# Altium schematic sheet resource.SchDoc
size A2
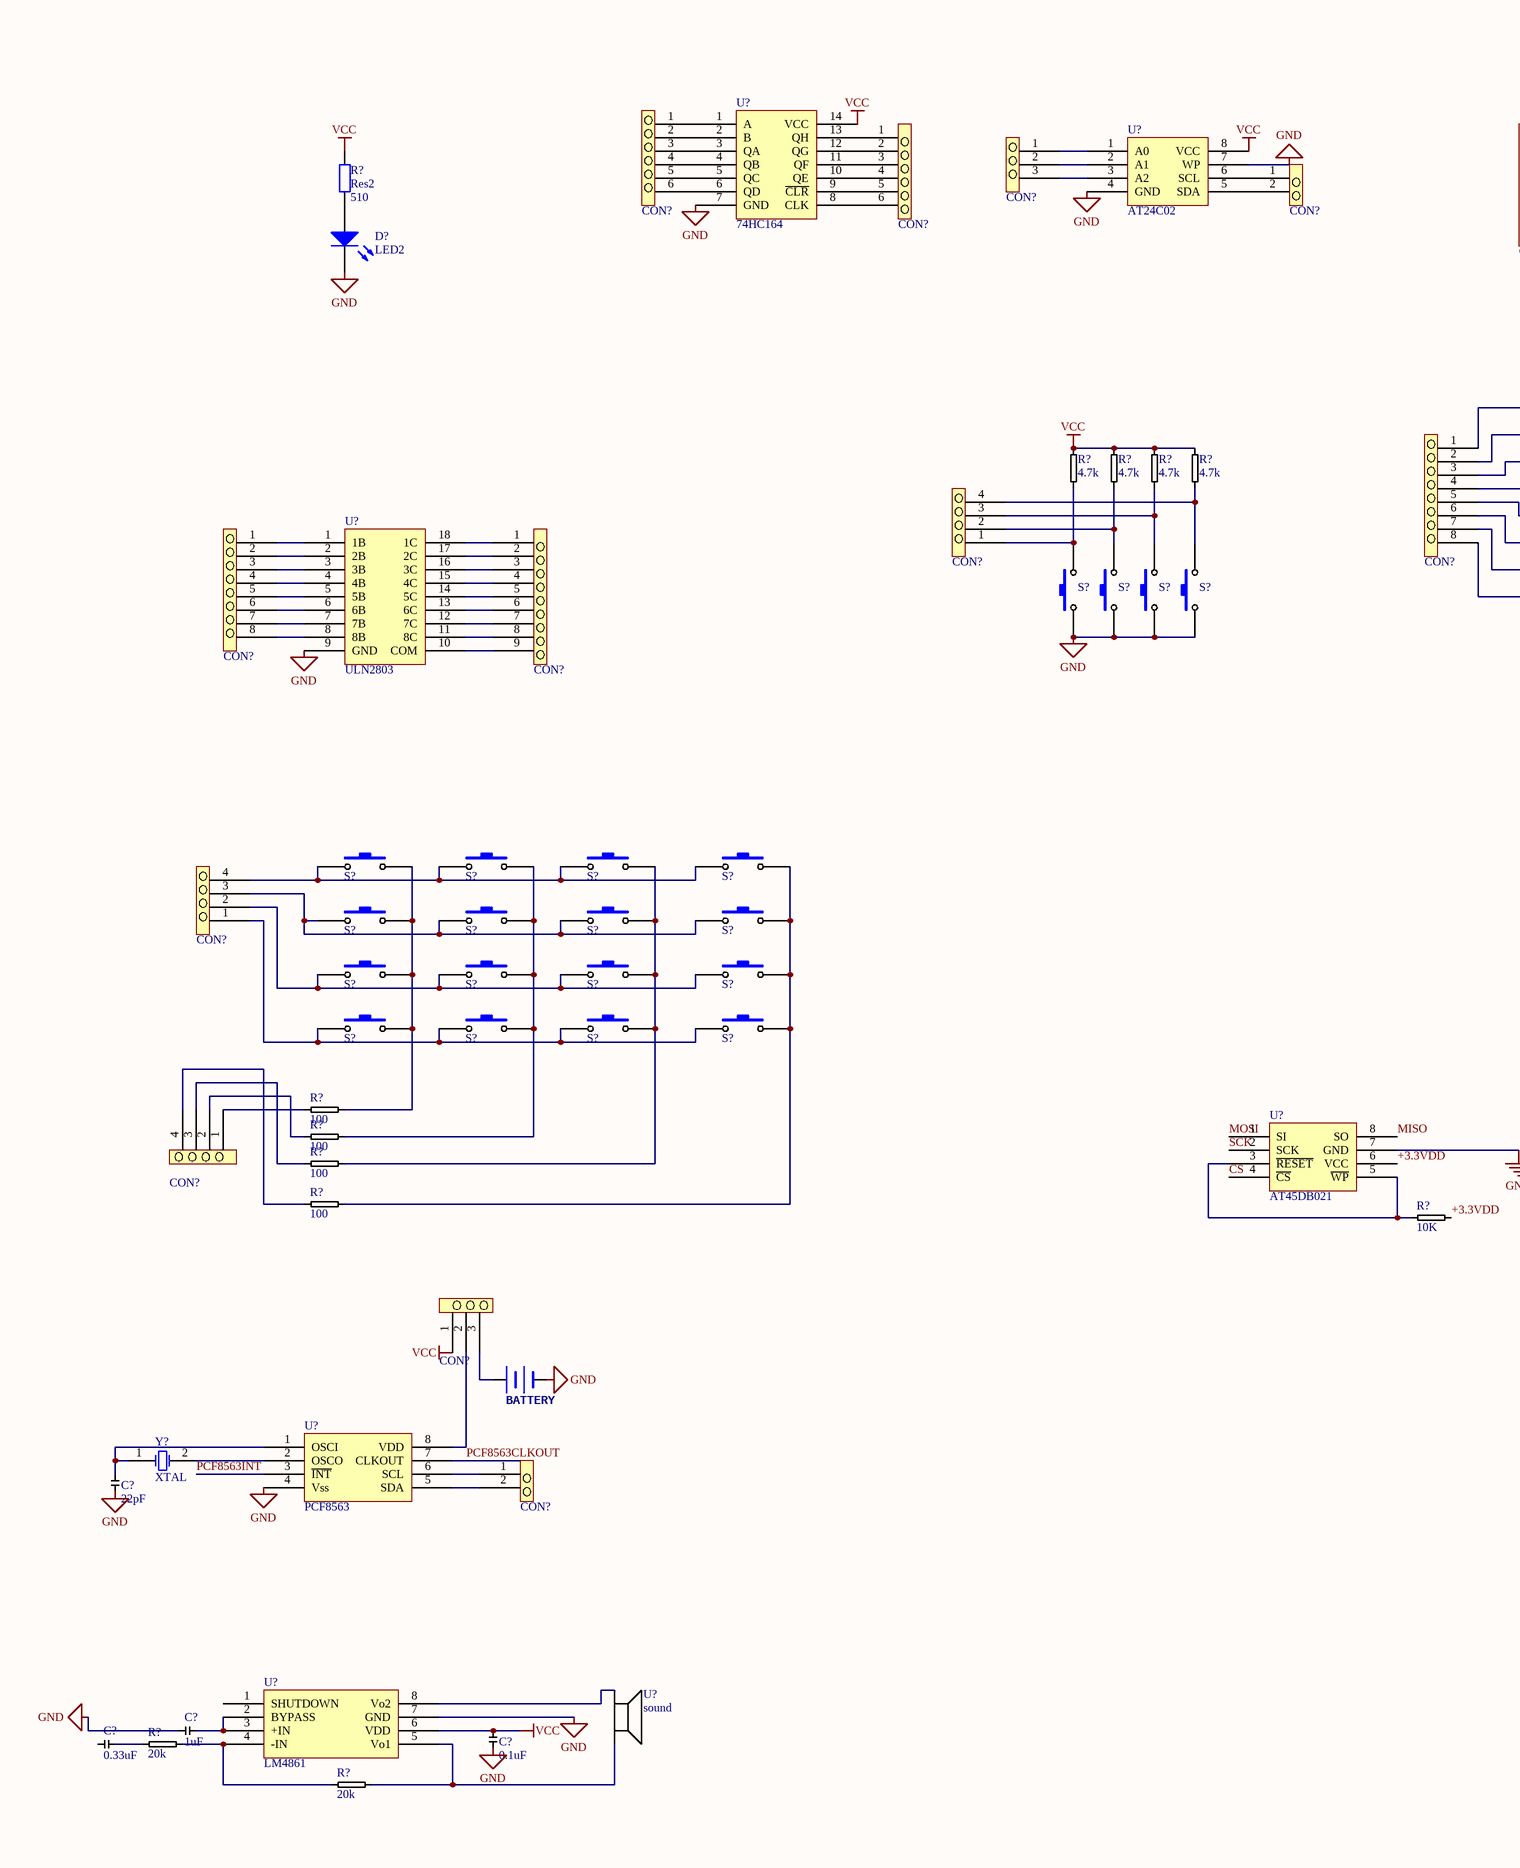
[diagram p0: resource.SchDoc, left]
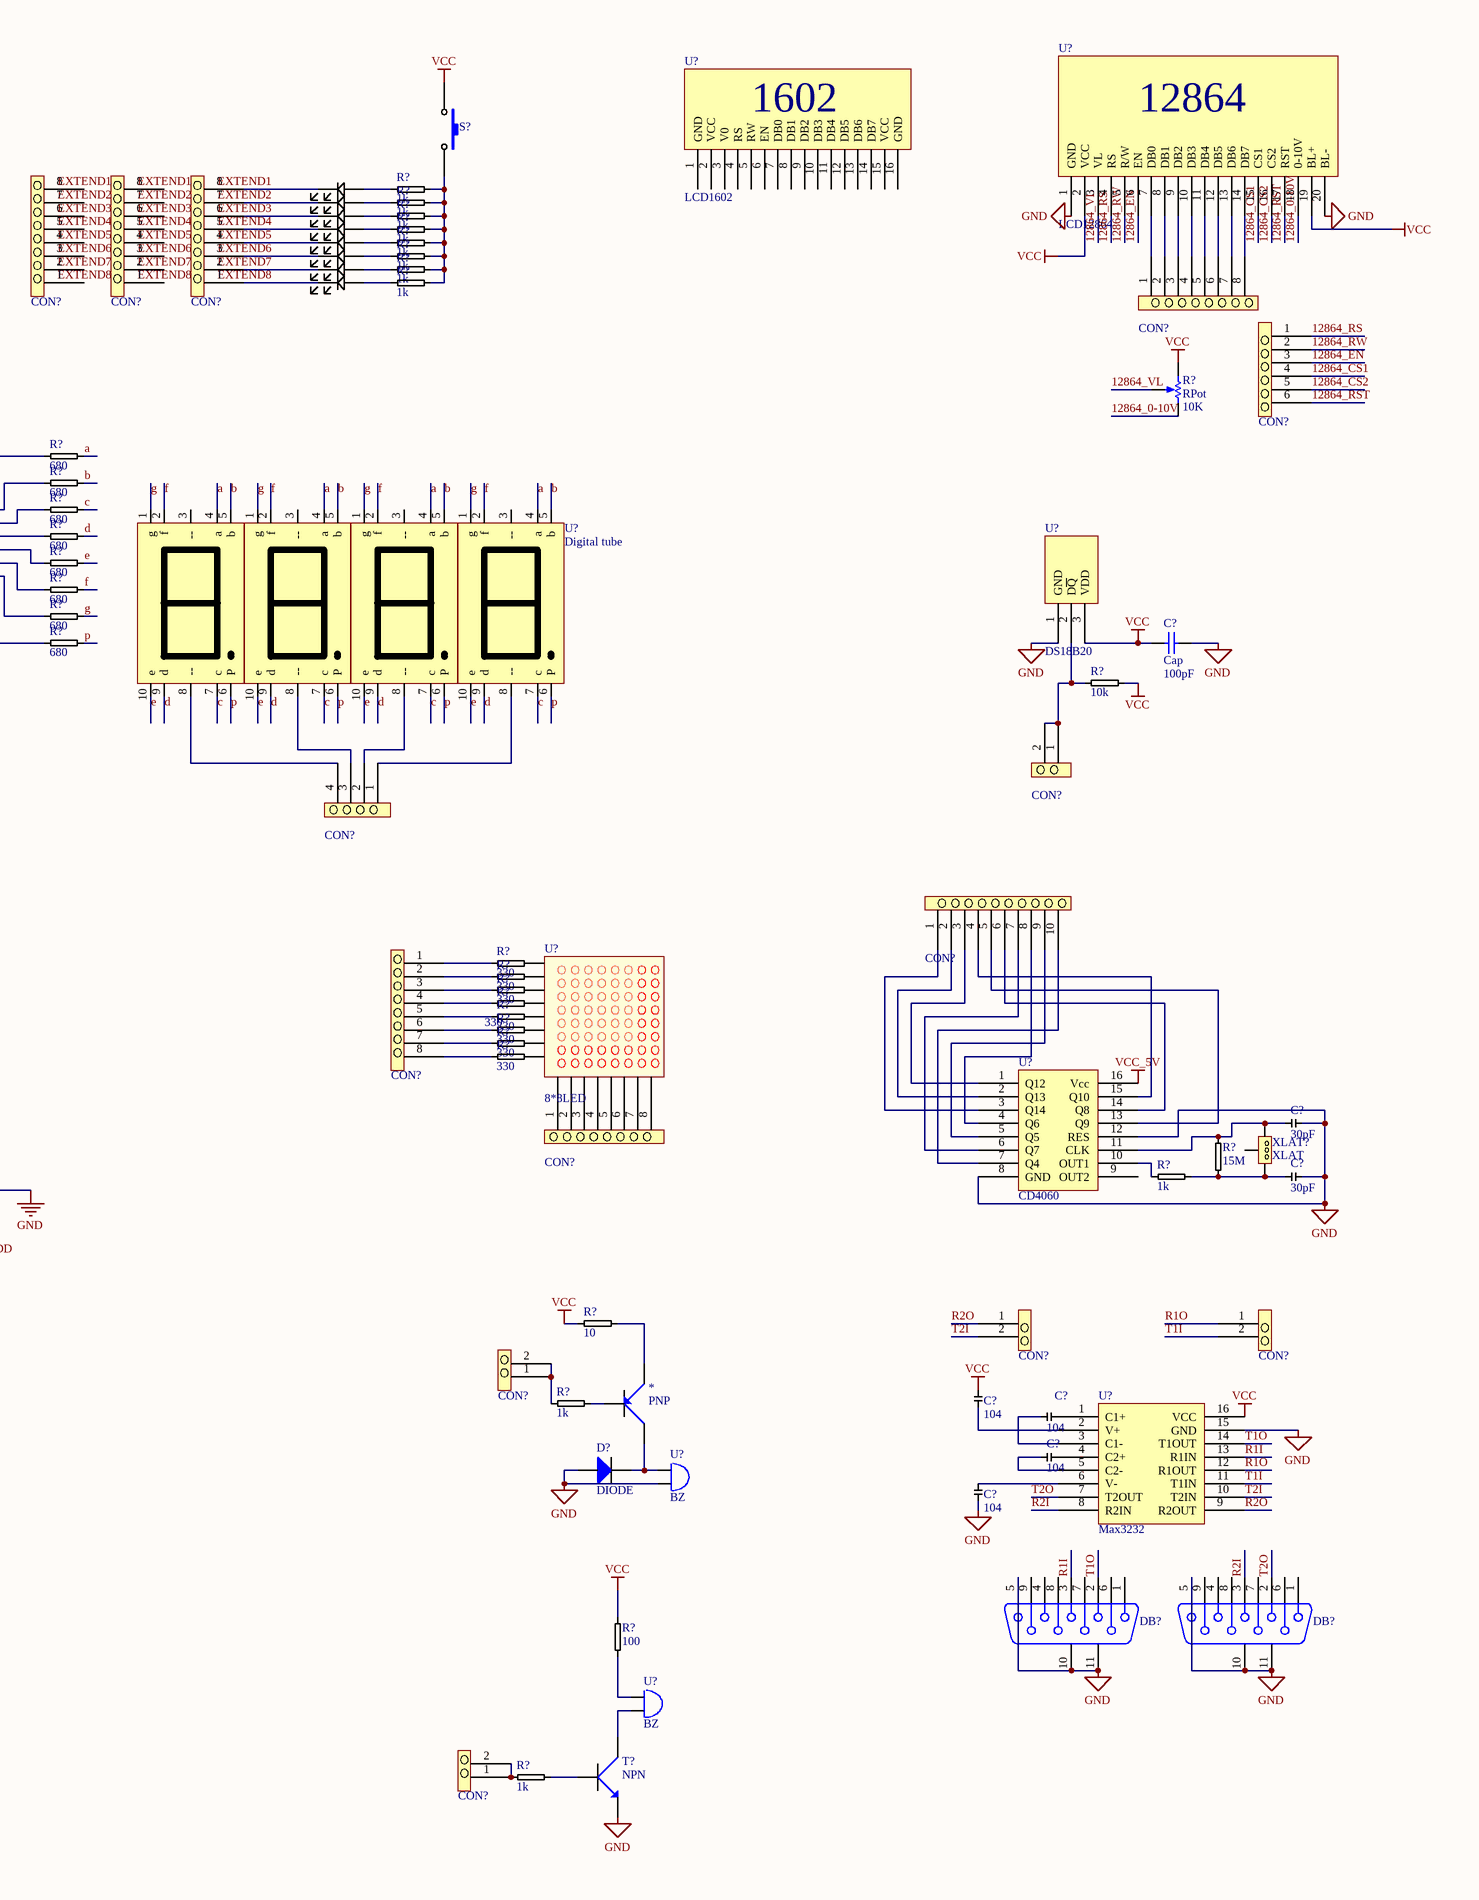
[diagram p1: resource.SchDoc, right]

## Parts
(Parts that share a designator on the sheet are numbered #1, #2 ... from top to bottom, then left to right.)
*  PNP
BT1  BATTERY  [BAT]
C?#1  Cap  value 100pF  [RAD-0.3]
C?#2  value 30pF  [0805]  (hidden comment: CAP)
C?#3  value 30pF  [0805]  (hidden comment: CAP)
C?#4  value 104  [0805]  (hidden comment: CAP)
C?#5  value 104  [0805]  (hidden comment: CAP)
C?#6  value 104  [0805]  (hidden comment: CAP)
C?#7  value 104  [0805]  (hidden comment: CAP)
C?#8  value 22pF  [0805]  (hidden comment: CAP)
C?#9  value 1uF  [0805]  (hidden comment: CAP)
C?#10  value 0.33uF  [0805]  (hidden comment: CAP)
C?#11  value 0.1uF  [0805]  (hidden comment: CAP)
CON?#1  Connector6  [SIP6]  (value not drawn)
CON?#2  Connector6  [SIP6]  (value not drawn)
CON?#3  Connector3  [SIP3]  (value not drawn)
CON?#4  Connector2  [SIP3]  (value not drawn)
CON?#5  Connector8  [SIP4]  (value not drawn)
CON?#6  Connector8  [SIP4]  (value not drawn)
CON?#7  Connector8  [SIP4]  (value not drawn)
CON?#8  Connector8  [SIP4]  (value not drawn)
CON?#9  Connector6  [SIP6]  (value not drawn)
CON?#10  Connector8  [SIP4]  (value not drawn)
CON?#11  Connector8  [SIP4]  (value not drawn)
CON?#12  Connector9  [SIP4]  (value not drawn)
CON?#13  Connector4  [SIP4]  (value not drawn)
CON?#14  Connector2  [SIP3]  (value not drawn)
CON?#15  Connector4  [SIP4]  (value not drawn)
CON?#16  Connector10  [SIP4]  (value not drawn)
CON?#17  Connector8  [SIP4]  (value not drawn)
CON?#18  Connector4  [SIP4]  (value not drawn)
CON?#19  Connector8  [SIP4]  (value not drawn)
CON?#20  Connector4  [SIP4]  (value not drawn)
CON?#21  Connector2  [SIP3]  (value not drawn)
CON?#22  Connector2  [SIP3]  (value not drawn)
CON?#23  Connector3  [SIP3]  (value not drawn)
CON?#24  Connector2  [SIP3]  (value not drawn)
CON?#25  Connector2  [SIP3]  (value not drawn)
CON?#26  Connector2  [SIP3]  (value not drawn)
D?#1  LED2  [LEDPOWER]
D?#2  DIODE
DB?#1  D Connector 9  [DB9_2]  (value not drawn)
DB?#2  D Connector 9  [DB9_2]  (value not drawn)
LED?#1  LED  [LEDpower]  (value not drawn)
LED?#2  LED  [LEDpower]  (value not drawn)
LED?#3  LED  [LEDpower]  (value not drawn)
LED?#4  LED  [LEDpower]  (value not drawn)
LED?#5  LED  [LEDpower]  (value not drawn)
LED?#6  LED  [LEDpower]  (value not drawn)
LED?#7  LED  [LEDpower]  (value not drawn)
LED?#8  LED  [LEDpower]  (value not drawn)
R?#1  value 1k  [0805]  (hidden comment: RESISTOR)
R?#2  value 1k  [0805]  (hidden comment: RESISTOR)
R?#3  value 1k  [0805]  (hidden comment: RESISTOR)
R?#4  value 1k  [0805]  (hidden comment: RESISTOR)
R?#5  Res2  value 510  [0805]
R?#6  value 1k  [0805]  (hidden comment: RESISTOR)
R?#7  value 1k  [0805]  (hidden comment: RESISTOR)
R?#8  value 1k  [0805]  (hidden comment: RESISTOR)
R?#9  value 1k  [0805]  (hidden comment: RESISTOR)
R?#10  RPot  value 10K  [VR5]
R?#11  value 680  [0805]  (hidden comment: RESISTOR)
R?#12  value 680  [0805]  (hidden comment: RESISTOR)
R?#13  value 680  [0805]  (hidden comment: RESISTOR)
R?#14  value 4.7k  [0805]  (hidden comment: RESISTOR)
R?#15  value 4.7k  [0805]  (hidden comment: RESISTOR)
R?#16  value 4.7k  [0805]  (hidden comment: RESISTOR)
R?#17  value 4.7k  [0805]  (hidden comment: RESISTOR)
R?#18  value 680  [0805]  (hidden comment: RESISTOR)
R?#19  value 680  [0805]  (hidden comment: RESISTOR)
R?#20  value 680  [0805]  (hidden comment: RESISTOR)
R?#21  value 680  [0805]  (hidden comment: RESISTOR)
R?#22  value 680  [0805]  (hidden comment: RESISTOR)
R?#23  value 10k  [0805]  (hidden comment: RESISTOR)
R?#24  value 330  [0805]  (hidden comment: RESISTOR)
R?#25  value 330  [0805]  (hidden comment: RESISTOR)
R?#26  value 330  [0805]  (hidden comment: RESISTOR)
R?#27  value 330  [0805]  (hidden comment: RESISTOR)
R?#28  value 330  [0805]  (hidden comment: RESISTOR)
R?#29  value 330  [0805]  (hidden comment: RESISTOR)
R?#30  value 330  [0805]  (hidden comment: RESISTOR)
R?#31  value 330  [0805]  (hidden comment: RESISTOR)
R?#32  value 100  [0805]  (hidden comment: RESISTOR)
R?#33  value 15M  [0805]  (hidden comment: RESISTOR)
R?#34  value 100  [0805]  (hidden comment: RESISTOR)
R?#35  value 1k  [0805]  (hidden comment: RESISTOR)
R?#36  value 100  [0805]  (hidden comment: RESISTOR)
R?#37  value 100  [0805]  (hidden comment: RESISTOR)
R?#38  value 10K  [0805]  (hidden comment: RESISTOR)
R?#39  value 10  [0805]  (hidden comment: RESISTOR)
R?#40  value 1k  [0805]  (hidden comment: RESISTOR)
R?#41  value 100  [0805]  (hidden comment: RESISTOR)
R?#42  value 20k  [0805]  (hidden comment: RESISTOR)
R?#43  value 1k  [0805]  (hidden comment: RESISTOR)
R?#44  value 20k  [0805]  (hidden comment: RESISTOR)
S?#1  SW-PB  [SW-PB]  (value not drawn)
S?#2  SW-PB  [SW-PB]  (value not drawn)
S?#3  SW-PB  [SW-PB]  (value not drawn)
S?#4  SW-PB  [SW-PB]  (value not drawn)
S?#5  SW-PB  [SW-PB]  (value not drawn)
S?#6  SW-PB  [SW-PB]  (value not drawn)
S?#7  SW-PB  [SW-PB]  (value not drawn)
S?#8  SW-PB  [SW-PB]  (value not drawn)
S?#9  SW-PB  [SW-PB]  (value not drawn)
S?#10  SW-PB  [SW-PB]  (value not drawn)
S?#11  SW-PB  [SW-PB]  (value not drawn)
S?#12  SW-PB  [SW-PB]  (value not drawn)
S?#13  SW-PB  [SW-PB]  (value not drawn)
S?#14  SW-PB  [SW-PB]  (value not drawn)
S?#15  SW-PB  [SW-PB]  (value not drawn)
S?#16  SW-PB  [SW-PB]  (value not drawn)
S?#17  SW-PB  [SW-PB]  (value not drawn)
S?#18  SW-PB  [SW-PB]  (value not drawn)
S?#19  SW-PB  [SW-PB]  (value not drawn)
S?#20  SW-PB  [SW-PB]  (value not drawn)
S?#21  SW-PB  [SW-PB]  (value not drawn)
T?  NPN
U?#1  LCD12864
U?#2  LCD1602
U?#3  74HC164  [DIP14]
U?#4  AT24C02  [DIP8]
U?#5  Digital tube  [Digital tube]
U?#6  Digital tube  [Digital tube]
U?#7  Digital tube  [Digital tube]
U?#8  Digital tube  [Digital tube]
U?#9  DS18B20
U?#10  ULN2803  [DIP18]
U?#11  8*8LED
U?#12  CD4060  [DIP16]
U?#13  AT45DB021
U?#14  PCF8563  [SOP8]
U?#15  BZ
U?#16  Max3232  [SOP16]
U?#17  BZ
U?#18  LM4861
U?#19  sound
XLAT?  XLAT
Y?  XTAL  [BCY-W2/D3.1]

## Nets
GND: BT1.2(-) C?#1.2 C?#2.2 C?#3.2 C?#7.2 C?#8.1 C?#9.1 C?#11.1 D?#1.2(K) D?#2.1 DB?#1.5 DB?#1.10(MH1) DB?#1.11(MH2) DB?#2.5 DB?#2.10(MH1) DB?#2.11(MH2) S?#2.1 S?#3.1 S?#4.1 S?#5.1 T?.3 U?#1.1(GND) U?#1.20(BL-) U?#3.7(GND) U?#4.4(GND) U?#4.7(WP) U?#9.1(GND) U?#10.9(GND) U?#12.8(GND) U?#12.12(RES) U?#13.7(GND) U?#14.4(Vss) U?#16.15(GND) U?#18.7(GND)
VCC: C?#1.1 C?#4.2 C?#11.2 CON?#23.1 R?#5.2 R?#10.1(TOP) R?#14.2 R?#15.2 R?#16.2 R?#17.2 R?#23.2 R?#39.1 R?#41.2 S?#1.1 U?#1.2(VCC) U?#1.19(BL+) U?#3.14(VCC) U?#4.8(VCC) U?#9.3(VDD) U?#16.16(VCC) U?#18.6(VDD)
VCC_5V: U?#12.16(Vcc)
12864_0-10V: R?#10.2(BOT) U?#1.18(0-10V)
12864_CS1: CON?#9.4 U?#1.15(CS1)
12864_CS2: CON?#9.5 U?#1.16(CS2)
12864_EN: CON?#9.3 U?#1.6(EN)
12864_RS: CON?#9.1 U?#1.4(RS)
12864_RST: CON?#9.6 U?#1.17(RST)
12864_RW: CON?#9.2 U?#1.5(R/W)
12864_VL: R?#10.3(TAP) U?#1.3(VL)
+3.3VDD: R?#38.2 U?#13.6(VCC)
a: R?#11.2 U?#5.4(a) U?#6.4(a) U?#7.4(a) U?#8.4(a)
b: R?#12.2 U?#5.5(b) U?#6.5(b) U?#7.5(b) U?#8.5(b)
c: R?#13.2 U?#5.7(c) U?#6.7(c) U?#7.7(c) U?#8.7(c)
CS: U?#13.4(~{CS})
d: R?#18.2 U?#5.9(d) U?#6.9(d) U?#7.9(d) U?#8.9(d)
e: R?#19.2 U?#5.10(e) U?#6.10(e) U?#7.10(e) U?#8.10(e)
f: R?#20.2 U?#5.2(f) U?#6.2(f) U?#7.2(f) U?#8.2(f)
g: R?#21.2 U?#5.1(g) U?#6.1(g) U?#7.1(g) U?#8.1(g)
MISO: U?#13.8(SO)
MOSI: U?#13.1(SI)
p: R?#22.2 U?#5.6(P) U?#6.6(P) U?#7.6(P) U?#8.6(P)
PCF8563CLKOUT: U?#14.7(CLKOUT)
PCF8563INT: U?#14.3(~{INT})
R1I: DB?#1.3 U?#16.13(R1IN)
R1O: CON?#22.1 U?#16.12(R1OUT)
R2I: DB?#2.3 U?#16.8(R2IN)
R2O: CON?#21.1 U?#16.9(R2OUT)
SCK: U?#13.2(SCK)
T1I: CON?#22.2 U?#16.11(T1IN)
T1O: DB?#1.2 U?#16.14(T1OUT)
T2I: CON?#21.2 U?#16.10(T2IN)
T2O: DB?#2.2 U?#16.7(T2OUT)
Net*_1: *.1 D?#2.2
Net*_2: *.2 R?#40.2
Net*_3: *.3 R?#39.2
NetBT1_1: BT1.1(+) CON?#23.3
NetC?#2_1: C?#2.1 R?#33.2 U?#12.11(CLK) XLAT?.1
NetC?#3_1: C?#3.1 R?#33.1 R?#35.2 XLAT?.2
NetC?#4_1: C?#4.1 U?#16.2(V+)
NetC?#5_1: C?#5.1 U?#16.1(C1+)
NetC?#5_2: C?#5.2 U?#16.3(C1-)
NetC?#6_1: C?#6.1 U?#16.4(C2+)
NetC?#6_2: C?#6.2 U?#16.5(C2-)
NetC?#7_1: C?#7.1 U?#16.6(V-)
NetC?#8_2: C?#8.2 U?#14.1(OSCI) Y?.1(OSC1)
NetC?#9_2: C?#9.2 U?#18.2(BYPASS) U?#18.3(+IN)
NetC?#10_2: C?#10.2 R?#42.1
NetCON?#1_1: CON?#1.1 U?#3.1(A)
NetCON?#1_2: CON?#1.2 U?#3.2(B)
NetCON?#1_3: CON?#1.3 U?#3.3(QA)
NetCON?#1_4: CON?#1.4 U?#3.4(QB)
NetCON?#1_5: CON?#1.5 U?#3.5(QC)
NetCON?#1_6: CON?#1.6 U?#3.6(QD)
NetCON?#2_1: CON?#2.1 U?#3.13(QH)
NetCON?#2_2: CON?#2.2 U?#3.12(QG)
NetCON?#2_3: CON?#2.3 U?#3.11(QF)
NetCON?#2_4: CON?#2.4 U?#3.10(QE)
NetCON?#2_5: CON?#2.5 U?#3.9(~{CLR})
NetCON?#2_6: CON?#2.6 U?#3.8(CLK)
NetCON?#3_1: CON?#3.1 U?#4.1(A0)
NetCON?#3_2: CON?#3.2 U?#4.2(A1)
NetCON?#3_3: CON?#3.3 U?#4.3(A2)
NetCON?#4_1: CON?#4.1 U?#4.6(SCL)
NetCON?#4_2: CON?#4.2 U?#4.5(SDA)
NetCON?#7_1: CON?#7.1 LED?#8.2
NetCON?#7_2: CON?#7.2 LED?#7.2
NetCON?#7_3: CON?#7.3 LED?#6.2
NetCON?#7_4: CON?#7.4 LED?#5.2
NetCON?#7_5: CON?#7.5 LED?#4.2
NetCON?#7_6: CON?#7.6 LED?#3.2
NetCON?#7_7: CON?#7.7 LED?#2.2
NetCON?#7_8: CON?#7.8 LED?#1.2
NetCON?#8_1: CON?#8.1 U?#1.7(DB0)
NetCON?#8_2: CON?#8.2 U?#1.8(DB1)
NetCON?#8_3: CON?#8.3 U?#1.9(DB2)
NetCON?#8_4: CON?#8.4 U?#1.10(DB3)
NetCON?#8_5: CON?#8.5 U?#1.11(DB4)
NetCON?#8_6: CON?#8.6 U?#1.12(DB5)
NetCON?#8_7: CON?#8.7 U?#1.13(DB6)
NetCON?#8_8: CON?#8.8 U?#1.14(DB7)
NetCON?#10_1: CON?#10.1 R?#11.1
NetCON?#10_2: CON?#10.2 R?#12.1
NetCON?#10_3: CON?#10.3 R?#13.1
NetCON?#10_4: CON?#10.4 R?#18.1
NetCON?#10_5: CON?#10.5 R?#19.1
NetCON?#10_6: CON?#10.6 R?#20.1
NetCON?#10_7: CON?#10.7 R?#21.1
NetCON?#10_8: CON?#10.8 R?#22.1
NetCON?#11_1: CON?#11.1 U?#10.1(1B)
NetCON?#11_2: CON?#11.2 U?#10.2(2B)
NetCON?#11_3: CON?#11.3 U?#10.3(3B)
NetCON?#11_4: CON?#11.4 U?#10.4(4B)
NetCON?#11_5: CON?#11.5 U?#10.5(5B)
NetCON?#11_6: CON?#11.6 U?#10.6(6B)
NetCON?#11_7: CON?#11.7 U?#10.7(7B)
NetCON?#11_8: CON?#11.8 U?#10.8(8B)
NetCON?#12_1: CON?#12.1 U?#10.18(1C)
NetCON?#12_2: CON?#12.2 U?#10.17(2C)
NetCON?#12_3: CON?#12.3 U?#10.16(3C)
NetCON?#12_4: CON?#12.4 U?#10.15(4C)
NetCON?#12_5: CON?#12.5 U?#10.14(5C)
NetCON?#12_6: CON?#12.6 U?#10.13(6C)
NetCON?#12_7: CON?#12.7 U?#10.12(7C)
NetCON?#12_8: CON?#12.8 U?#10.11(8C)
NetCON?#12_9: CON?#12.9 U?#10.10(COM)
NetCON?#13_1: CON?#13.1 R?#14.1 S?#2.2
NetCON?#13_2: CON?#13.2 R?#15.1 S?#3.2
NetCON?#13_3: CON?#13.3 R?#16.1 S?#4.2
NetCON?#13_4: CON?#13.4 R?#17.1 S?#5.2
NetCON?#14_1: CON?#14.1 CON?#14.2 R?#23.1 U?#9.2(D~{Q})
NetCON?#15_1: CON?#15.1 U?#8.8(--)
NetCON?#15_2: CON?#15.2 U?#7.8(--)
NetCON?#15_3: CON?#15.3 U?#6.8(--)
NetCON?#15_4: CON?#15.4 U?#5.8(--)
NetCON?#16_1: CON?#16.1 U?#12.3(Q14)
NetCON?#16_2: CON?#16.2 U?#12.2(Q13)
NetCON?#16_3: CON?#16.3 U?#12.1(Q12)
NetCON?#16_4: CON?#16.4 U?#12.15(Q10)
NetCON?#16_5: CON?#16.5 U?#12.13(Q9)
NetCON?#16_6: CON?#16.6 U?#12.14(Q8)
NetCON?#16_7: CON?#16.7 U?#12.6(Q7)
NetCON?#16_8: CON?#16.8 U?#12.4(Q6)
NetCON?#16_9: CON?#16.9 U?#12.5(Q5)
NetCON?#16_10: CON?#16.10 U?#12.7(Q4)
NetCON?#17_1: CON?#17.1 R?#24.1
NetCON?#17_2: CON?#17.2 R?#25.1
NetCON?#17_3: CON?#17.3 R?#26.1
NetCON?#17_4: CON?#17.4 R?#27.1
NetCON?#17_5: CON?#17.5 R?#28.1
NetCON?#17_6: CON?#17.6 R?#29.1
NetCON?#17_7: CON?#17.7 R?#30.1
NetCON?#17_8: CON?#17.8 R?#31.1
NetCON?#18_1: CON?#18.1 S?#18.1 S?#19.1 S?#20.1 S?#21.1
NetCON?#18_2: CON?#18.2 S?#14.1 S?#15.1 S?#16.1 S?#17.1
NetCON?#18_3: CON?#18.3 S?#10.1 S?#11.1 S?#12.1 S?#13.1
NetCON?#18_4: CON?#18.4 S?#6.1 S?#7.1 S?#8.1 S?#9.1
NetCON?#19_1: CON?#19.1 U?#11.9
NetCON?#19_2: CON?#19.2 U?#11.10
NetCON?#19_3: CON?#19.3 U?#11.11
NetCON?#19_4: CON?#19.4 U?#11.12
NetCON?#19_5: CON?#19.5 U?#11.13
NetCON?#19_6: CON?#19.6 U?#11.14
NetCON?#19_7: CON?#19.7 U?#11.15
NetCON?#19_8: CON?#19.8 U?#11.16
NetCON?#20_1: CON?#20.1 R?#32.1
NetCON?#20_2: CON?#20.2 R?#34.1
NetCON?#20_3: CON?#20.3 R?#36.1
NetCON?#20_4: CON?#20.4 R?#37.1
NetCON?#23_2: CON?#23.2 U?#14.8(VDD)
NetCON?#24_1: CON?#24.1 CON?#24.2 R?#40.1
NetCON?#25_1: CON?#25.1 U?#14.6(SCL)
NetCON?#25_2: CON?#25.2 U?#14.5(SDA)
NetCON?#26_1: CON?#26.1 CON?#26.2 R?#43.1
NetD?#1_1: D?#1.1(A) R?#5.1
NetLED?#1_1: LED?#1.1 R?#1.1
NetLED?#2_1: LED?#2.1 R?#2.1
NetLED?#3_1: LED?#3.1 R?#3.1
NetLED?#4_1: LED?#4.1 R?#4.1
NetLED?#5_1: LED?#5.1 R?#6.1
NetLED?#6_1: LED?#6.1 R?#7.1
NetLED?#7_1: LED?#7.1 R?#8.1
NetLED?#8_1: LED?#8.1 R?#9.1
NetR?#1_2: R?#1.2 R?#2.2 R?#3.2 R?#4.2 R?#6.2 R?#7.2 R?#8.2 R?#9.2 S?#1.2
NetR?#24_2: R?#24.2 U?#11.1
NetR?#25_2: R?#25.2 U?#11.2
NetR?#26_2: R?#26.2 U?#11.3
NetR?#27_2: R?#27.2 U?#11.4
NetR?#28_2: R?#28.2 U?#11.5
NetR?#29_2: R?#29.2 U?#11.6
NetR?#30_2: R?#30.2 U?#11.7
NetR?#31_2: R?#31.2 U?#11.8
NetR?#32_2: R?#32.2 S?#6.2 S?#10.2 S?#14.2 S?#18.2
NetR?#34_2: R?#34.2 S?#7.2 S?#11.2 S?#15.2 S?#19.2
NetR?#35_1: R?#35.1 U?#12.10(OUT1)
NetR?#36_2: R?#36.2 S?#8.2 S?#12.2 S?#16.2 S?#20.2
NetR?#37_2: R?#37.2 S?#9.2 S?#13.2 S?#17.2 S?#21.2
NetR?#38_1: R?#38.1 U?#13.3(~{RESET}) U?#13.5(~{WP})
NetR?#42_2: R?#42.2 R?#44.1 U?#18.4(-IN)
NetR?#43_2: R?#43.2 T?.2
NetR?#44_2: R?#44.2 U?#18.5(Vo1) U?#19.2
NetU?#14_2: U?#14.2(OSCO) Y?.2(OSC2)
NetU?#18_8: U?#18.8(Vo2) U?#19.1

Not connected (* = marked no-connect by the designer): C?#10 1; CON?#5 1 2 3 4 5 6 7 8; CON?#6 1 2 3 4 5 6 7 8; DB?#1 1 4 6 7 8 9; DB?#2 1 4 6 7 8 9; R?#41 1; T? 1; U?#2 1(GND) 2(VCC) 3(V0) 4(RS) 5(RW) 6(EN) 7(DB0) 8(DB1) 9(DB2) 10(DB3) 11(DB4) 12(DB5) 13(DB6) 14(DB7) 15(VCC) 16(GND); U?#5 3(--); U?#6 3(--); U?#7 3(--); U?#8 3(--); U?#12 9(OUT2); U?#15 1 2; U?#17 1 2; U?#18 1(SHUTDOWN); XLAT? ?1

## Notes on the sheet
- Labels drawn without touching a wire or pin: EXTEND1, EXTEND2, EXTEND3, EXTEND4, EXTEND5, EXTEND6, EXTEND7, EXTEND8
- (in symbol LCD1602) 1602
- (in symbol LCD12864) 12864

## Library data of the parts
C?#1 = Cap: Capacitor; Published: 8-Jun-2000; LatestRevisionDate: 17-Jul-2002; LatestRevisionNote: Re-released for DXP Platform.; PackageReference: RAD-0.3; Publisher: Altium Limited
D?#1 = LED2: Typical RED, GREEN, YELLOW, AMBER GaAs LED; Published: 8-Jun-2000; LatestRevisionDate: 17-Jul-2002; LatestRevisionNote: Re-released for DXP Platform.; PackageVersion: Feb-2002; PackageReference: 3.2X1.6X1.1; Publisher: Altium Limited
DB?#1 DB?#2 = D Connector 9: Receptacle Assembly, 9 Position, Right Angle; PackageDocument: O; Positions: 9; Published: 15-Jun-2001; LatestRevisionDate: 17-Jul-2002; LatestRevisionNote: Re-released for DXP Platform.; DatasheetDocument: 1-Sep-1999; PackageReference: 788750; Publisher: Altium Limited; Orientation: Right Angle; Gender: Receptacle
R?#1-R?#4 R?#6-R?#9 R?#11-R?#44 = RES
R?#5 = Res2: Resistor; Published: 8-Jun-2000; LatestRevisionDate: 17-Jul-2002; LatestRevisionNote: Re-released for DXP Platform.; PackageReference: AXIAL-0.4; Publisher: Altium Limited
R?#10 = RPot: Potentiometer; Sim Note: Enter the Resistance value and the set point into parameter fields.; Set Position: 0.5; Published: 8-Jun-2000; LatestRevisionDate: 17-Jul-2002; LatestRevisionNote: Re-released for DXP Platform.; PackageReference: VR5; Publisher: Altium Limited
S?#1-S?#21 = SW-PB: Switch; Published: 24-Mar-1999; LatestRevisionDate: 17-Jul-2002; LatestRevisionNote: Re-released for DXP Platform.; PackageReference: SPST-2; Publisher: Altium Limited
XLAT? = MYXLAT: VALUE: 2.048M
Y? = XTAL: Crystal Oscillator; Published: 8-Jun-2000; LatestRevisionDate: 17-Jul-2002; LatestRevisionNote: Re-released for DXP Platform.; PackageReference: R38; Publisher: Altium Limited